# EAGLE schematic Schamatic (EAGLE 9.4.1)
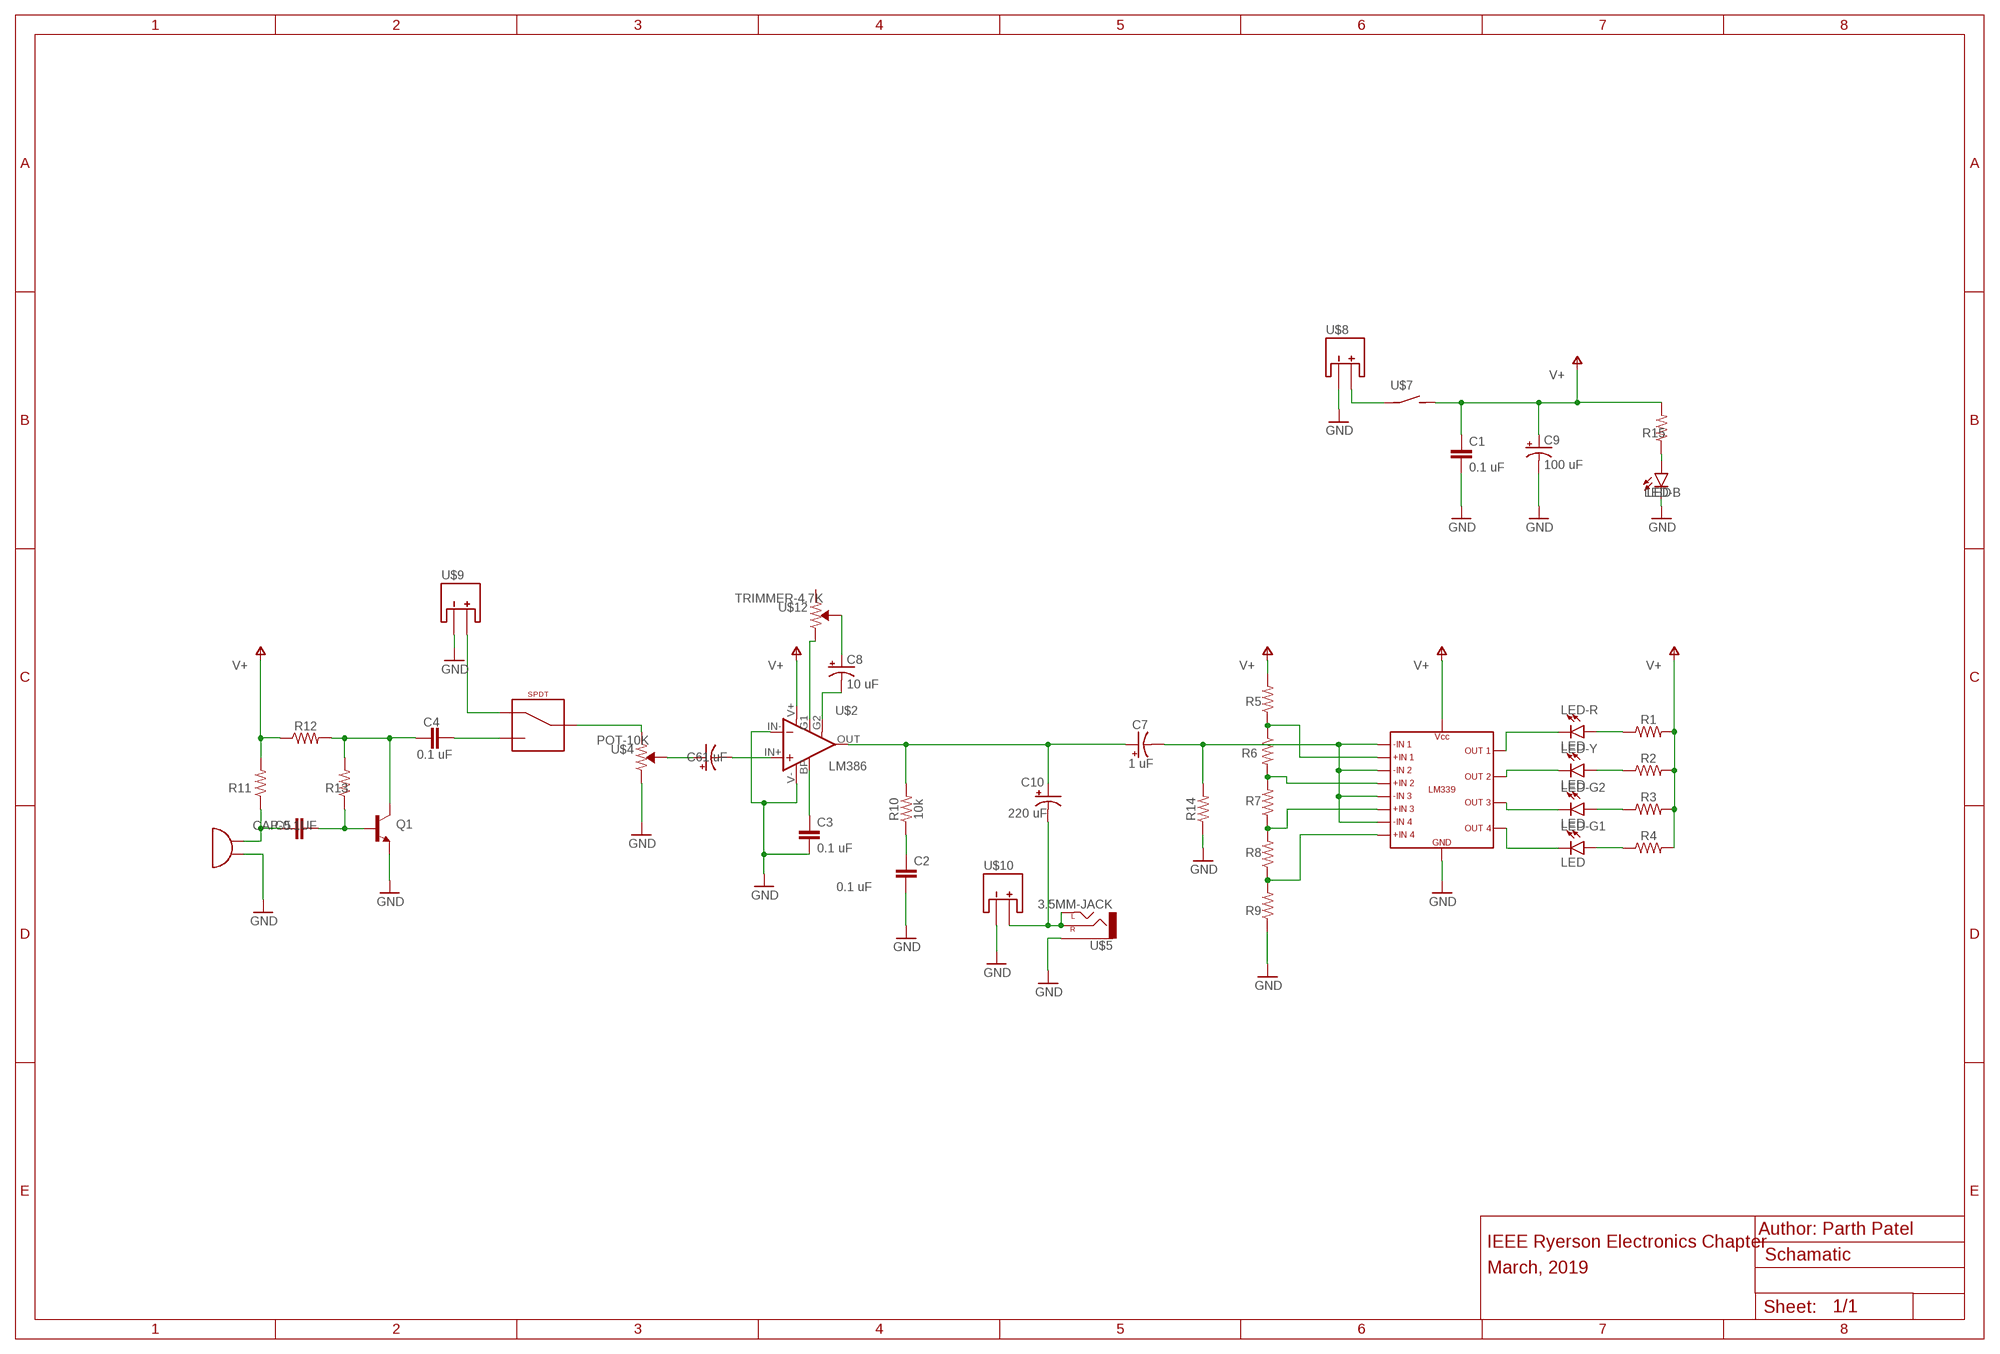
[diagram p0: schematic, sheet 1]

## Parts
C1  0.1 uF  CAP-0.1UF  [CAP-PTH-SMALL-KIT]
C2  0.1 uF  CAP-0.1UF  [CAP-PTH-SMALL-KIT]
C3  0.1 uF  CAP-0.1UF  [CAP-PTH-SMALL-KIT]
C4  0.1 uF  CAP-0.1UF  [CAP-PTH-SMALL-KIT]
C5  CAP-0.1UF  [CAP-PTH-SMALL-KIT]
C6  1 uF  CAP-1UF  [CPOL-RADIAL-2.5MM-5.2MM]
C7  1 uF  CAP-1UF  [CPOL-RADIAL-2.5MM-5.2MM]
C8  10 uF  CAP-10UF  [CPOL-RADIAL-2.5MM-5.2MM]
C9  100 uF  CAP-100UF  [CPOL-RADIAL-2.5MM-6.5MM]
C10  220 uF  CAP-220UF  [CPOL-RADIAL-2.5MM-8.1MM]
LED-B  LED  [LED_5MM-KIT]
LED-G1  LED  [LED_5MM-KIT]
LED-G2  LED  [LED_5MM-KIT]
LED-R  LED  [LED_5MM-KIT]
LED-Y  LED  [LED_5MM-KIT]
Q1  2N3904  [TO92-CBE]
R1  470  RESISTOR  [AXIAL-0.3-KIT]
R2  RESISTOR  [AXIAL-0.3-KIT]
R3  RESISTOR  [AXIAL-0.3-KIT]
R4  RESISTOR  [AXIAL-0.3-KIT]
R5  RESISTOR  [AXIAL-0.3-KIT]
R6  RESISTOR  [AXIAL-0.3-KIT]
R7  RESISTOR  [AXIAL-0.3-KIT]
R8  RESISTOR  [AXIAL-0.3-KIT]
R9  RESISTOR  [AXIAL-0.3-KIT]
R10  10k  RESISTOR  [AXIAL-0.3-KIT]
R11  RESISTOR  [AXIAL-0.3-KIT]
R12  RESISTOR  [AXIAL-0.3-KIT]
R13  RESISTOR  [AXIAL-0.3-KIT]
R14  RESISTOR  [AXIAL-0.3-KIT]
R15  RESISTOR  [AXIAL-0.3-KIT]
U$1  SPDT  [OS102011MA1QN1]
U$2  LM386  [DIL08]
U$3  LM339  [DIL14]
U$4  POT-10K  [PTV09-SERIES]
U$5  3.5MM-JACK  [SJ1-352XN]
U$6  MIC  [MIC]
U$7  SPST  [TMS6T1B1M1QE]
U$8  2PIN-CONNECTOR  [2PIN-CONN]
U$9  2PIN-CONNECTOR  [2PIN-CONN]
U$10  2PIN-CONNECTOR  [2PIN-CONN]
U$12  TRIMMER-4.7K  [CB10MV472ME]

## Nets
GND: C1.2 C2.2 C3.2 C9.- LED-B.-(C) Q1.E R9.P$1 R14.P$1 U$2.IN-(-IN) U$2.V- U$3.P$12(P12) U$4.P$3(CW) U$5.P$1(SLEEVE) U$6.- U$8.- U$9.- U$10.-
N$1: LED-R.+(A) R1.P$1
N$2: LED-Y.+(A) R2.P$1
N$3: LED-G2.+(A) R3.P$1
N$4: LED-G1.+(A) R4.P$1
N$5: R5.P$1 R6.P$1 U$3.P$7(P7)
N$6: LED-R.-(C) U$3.P$1(P1)
N$7: LED-Y.-(C) U$3.P$2(P2)
N$8: LED-G2.-(C) U$3.P$14(P14)
N$9: LED-G1.-(C) U$3.P$13(P13)
N$10: R6.P$2 R7.P$2 U$3.P$5(P5)
N$11: R7.P$1 R8.P$2 U$3.P$9(P9)
N$12: R8.P$1 R9.P$2 U$3.P$11(P11)
N$13: C7.- R14.P$2 U$3.P$4(P4) U$3.P$6(P6) U$3.P$8(P8) U$3.P$10(P10)
N$14: U$2.G1(GAIN) U$12.P$3(CW)
N$15: C8.+ U$12.P$2(WIPER)
N$16: C8.- U$2.G2(GAIN)
N$17: C6.+ U$4.P$2(WIPER)
N$18: C6.- U$2.IN+(+IN)
N$19: C10.- U$5.P$2(RIGHT) U$5.P$3(LEFT) U$10.+
N$20: U$1.P$2 U$4.P$1(CCW)
N$21: C7.+ C10.+ R10.P$2 U$2.OUT
N$22: C3.1 U$2.BP
N$23: C2.1 R10.P$1
N$24: C5.2 Q1.B R13.P$1
N$25: C5.1 R11.P$1 U$6.+
N$26: U$7.+(P) U$8.+
N$27: C4.1 Q1.C R12.P$2 R13.P$2
N$28: C4.2 U$1.P$3
N$29: U$1.P$1 U$9.+
N$31: LED-B.+(A) R15.P$1
V+: C1.1 C9.+ R1.P$2 R2.P$2 R3.P$2 R4.P$2 R5.P$2 R11.P$2 R12.P$1 R15.P$2 U$2.V+ U$3.P$3(P3) U$7.-(S)
Unconnected: U$12.P$1(CCW)

## Notes on the sheet
- Author: Parth Patel
- IEEE Ryerson Electronics Chapter
- March, 2019

## Library data of the parts
C1-C5 = ieee_rec:CAP-0.1UF: 0.1uf Non Polarized ceramic capicator
C6 C7 = ieee_rec:CAP-1UF: 1 uF Polarized Electrolytic Capicator - Through Hole
C8 = ieee_rec:CAP-10UF: 10 uF Polarized Electrolytic Capicator - Through Hole
C9 = ieee_rec:CAP-100UF: 100 uF Polarized Electrolytic Capicator - Through Hole
C10 = ieee_rec:CAP-220UF: 220 uF Polarized Electrolytic Capicator - Through Hole
LED-B LED-G1 LED-G2 LED-R LED-Y = ieee_rec:LED: 5mm Through-Hole LED
Q1 = ieee_rec:2N3904: 2n3094 Transistor
R1-R15 = ieee_rec:RESISTOR: 1/4w Standard Through-hole Resistor
U$1 = ieee_rec:SPDT: SPDT switch (ON-ON)
U$2 = ieee_rec:LM386: DIP 08 Package
U$3 = ieee_rec:LM339: DIP 14 Package
U$4 = ieee_rec:POT-10K: PTV09 Series - 9 mm Potentiometer
U$5 = ieee_rec:3.5MM-JACK: 3.5 mm Audio Jack
U$6 = ieee_rec:MIC: Electret Microphone Through-Hole
U$7 = ieee_rec:SPST: SPST Switch - Through Hole (ON/OFF)
U$8-U$10 = ieee_rec:2PIN-CONNECTOR: 2 pin Through-hole Connector
U$12 = ieee_rec:TRIMMER-4.7K: 4.7 kohm Trimmer Resistor